# EAGLE design FZZSHAP (EAGLE 9.2.2)
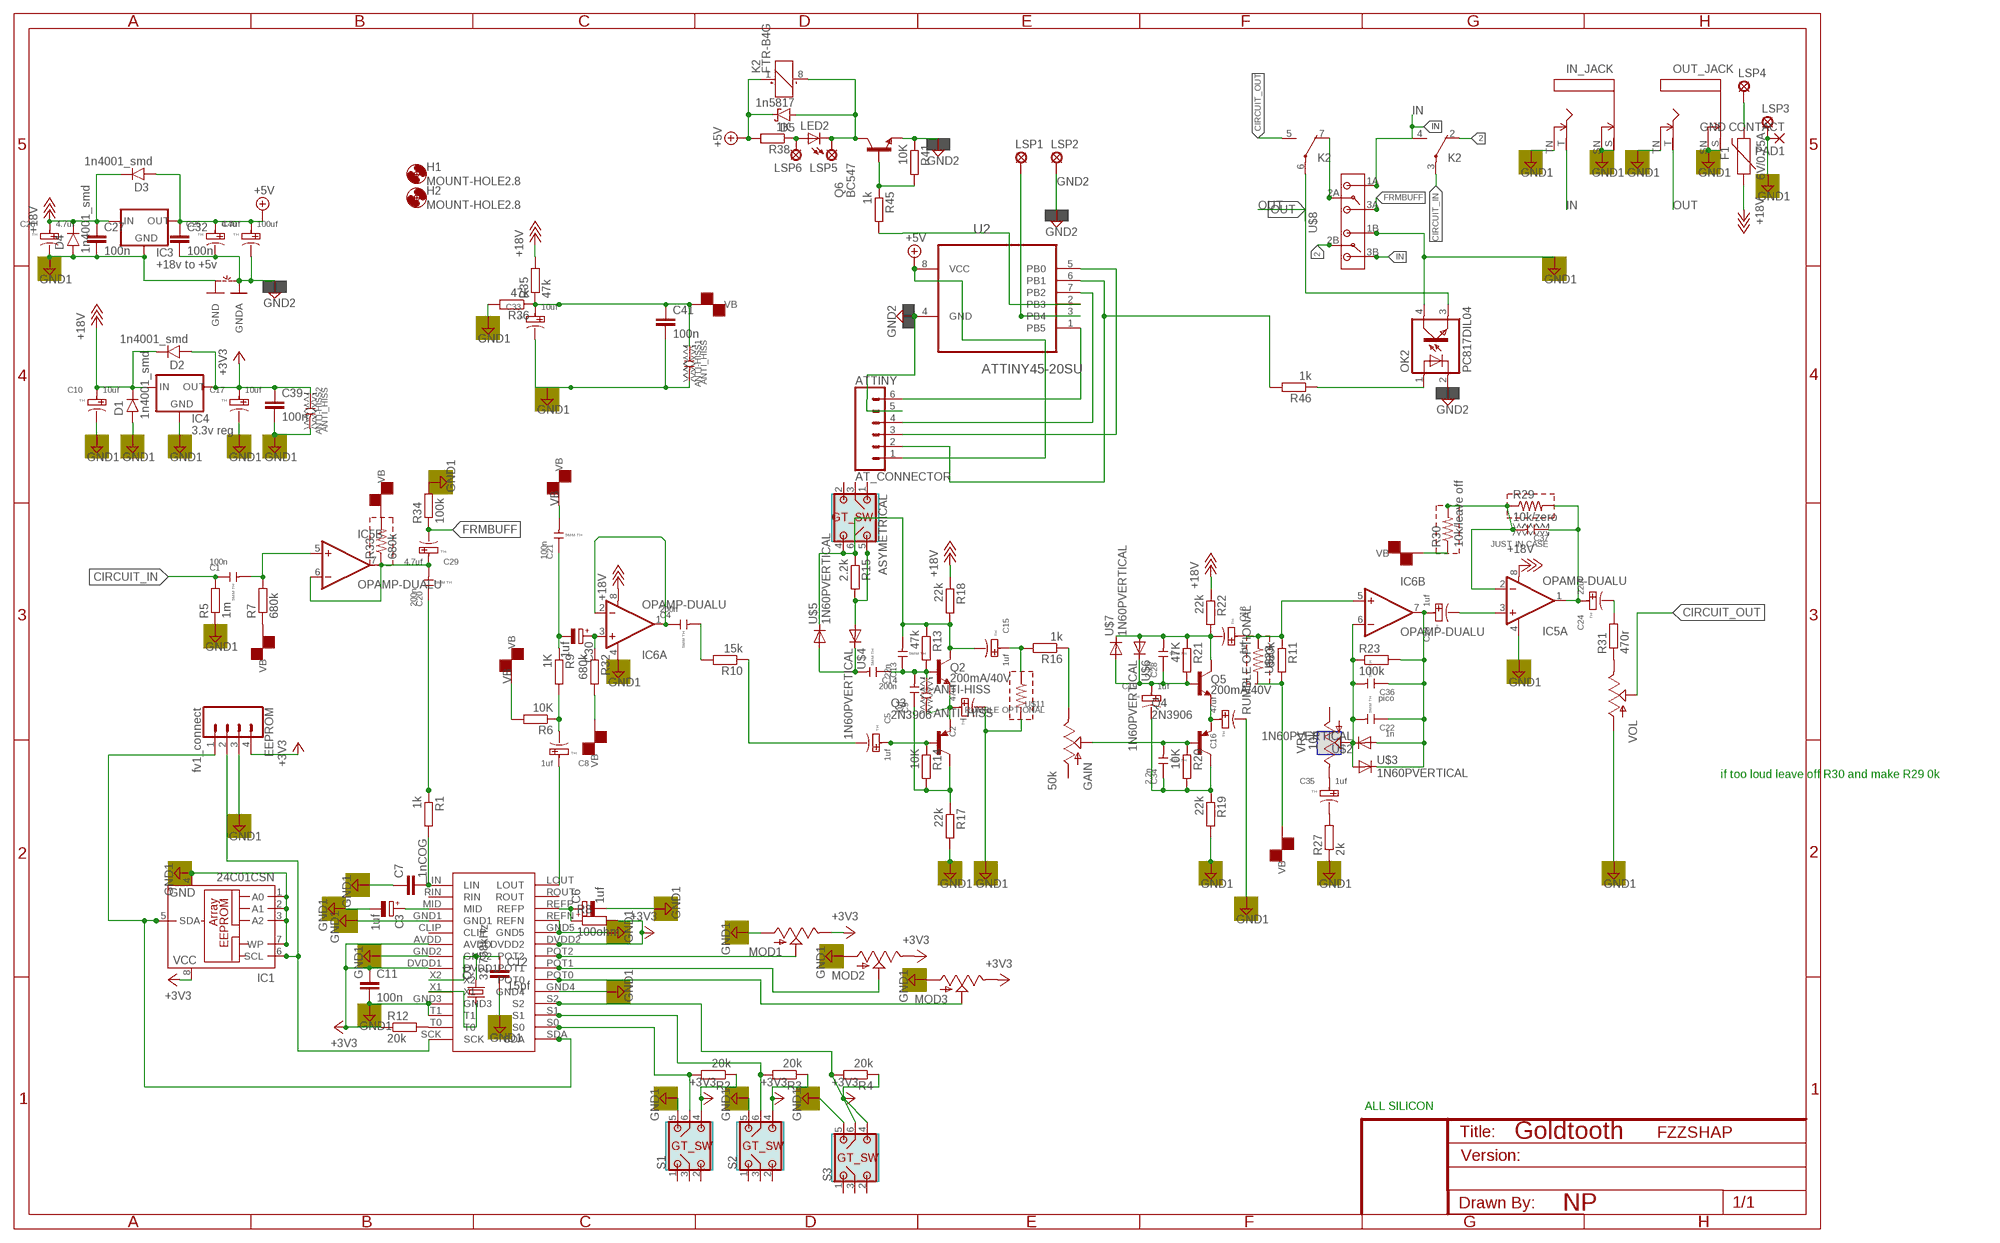
[diagram p0: schematic, sheet 1]

## Parts
ANTI-HISS  ANTI_HISS  SMDCERAMIC_1206_OPTIONAL  [SMD_OPTIONAL]
ANTI-HISS1  ANTI_HISS  SMDCERAMIC_1206_OPTIONAL  [SMD_OPTIONAL]
ANTI-HISS2  ANTI_HISS  SMDCERAMIC_1206_OPTIONAL  [SMD_OPTIONAL]
ASYMETRICAL  DP03HOLD_ADJUSTED  [DP-03_HOLE_ADJUSTED]
ATTINY  AT_CONNECTOR  CONN_06LONGPADS  [1X06_LONGPADS]
C1  100n  THRU_HOLE_5MM_SPACING  [CERAMIC-5MM]
C2  47uf  THRU-HOLE-POLARIZED  [PC-D5.3MM]
C3  1uf  CPOL-EUA/3216-18R  [A/3216-18R]
C4  200n  THRU_HOLE_5MM_SPACING  [CERAMIC-5MM]
C5  1uf  THRU-HOLE-POLARIZED  [PC-D5.3MM]
C6  1uf  CPOL-EUA/3216-18R  [A/3216-18R]
C7  1nCOG  C-EUC0805K  [C0805K]
C8  1uf  THRU-HOLE-POLARIZED  [PC-D5.3MM]
C9  1uf  THRU_HOLE_5MM_SPACING  [CERAMIC-5MM]
C10  10uf  THRU-HOLE-POLARIZED  [PC-D5.3MM]
C11  100n  C-EUC0805  [C0805]
C12  15pf  C-EUC0805  [C0805]
C13  22n  THRU_HOLE_5MM_SPACING  [CERAMIC-5MM]
C14  200n  THRU_HOLE_5MM_SPACING  [CERAMIC-5MM]
C15  1uf  THRU-HOLE-POLARIZED  [PC-D5.3MM]
C16  47uf  THRU-HOLE-POLARIZED  [PC-D5.3MM]
C17  10uf  THRU-HOLE-POLARIZED  [PC-D5.3MM]
C18  1uf  THRU-HOLE-POLARIZED  [PC-D5.3MM]
C19  1uf  THRU-HOLE-POLARIZED  [PC-D5.3MM]
C20  200n  THRU_HOLE_5MM_SPACING  [CERAMIC-5MM]
C21  100n  THRU_HOLE_5MM_SPACING  [CERAMIC-5MM]
C22  1n  THRU_HOLE_5MM_SPACING  [CERAMIC-5MM]
C23  1uf  THRU-HOLE-POLARIZED  [PC-D5.3MM]
C24  22uf  THRU-HOLE-POLARIZED  [PC-D5.3MM]
C25  4.7uf  THRU-HOLE-POLARIZED  [PC-D5.3MM]
C26  4.7uf  THRU-HOLE-POLARIZED  [PC-D5.3MM]
C27  100n  C-EUC1206  [C1206]
C28  2.2n  THRU_HOLE_5MM_SPACING  [CERAMIC-5MM]
C29  4.7uf  THRU-HOLE-POLARIZED  [PC-D5.3MM]
C30  1uf  CPOL-EUA/3216-18R  [A/3216-18R]
C32  100n  C-EUC1206  [C1206]
C33  10uf  THRU-HOLE-POLARIZED  [PC-D5.3MM]
C34  2.2n  THRU_HOLE_5MM_SPACING  [CERAMIC-5MM]
C35  1uf  THRU-HOLE-POLARIZED  [PC-D5.3MM]
C36  pico  THRU_HOLE_5MM_SPACING  [CERAMIC-5MM]
C37  JUST IN CASE  SMDCERAMIC_1206_OPTIONAL  [SMD_OPTIONAL]
C39  100n  C-EUC1206  [C1206]
C40  100uf  THRU-HOLE-POLARIZED  [PC-D5.3MM]
C41  100n  C-EUC1206  [C1206]
D1  1n4001_smd  1N400X.1  [DO41-1]
D2  1n4001_smd  1N400X.1  [DO41-1]
D3  1n4001_smd  1N400X.1  [DO41-1]
D4  1n4001_smd  1N400X.1  [DO41-1]
D5  1n5817  SCHOTTKY-DIODESMD  [SMB]
EEPROM  fv1_connect  CONN_04LONGPADS  [1X04_LONGPADS]
F1  6V/0.75A  PPTC_THREE-QUARTER-AMP  [1206]
GAIN  50k  POTHOLER  [HOLE]
H1  MOUNT-HOLE2.8  [2,8]
H2  MOUNT-HOLE2.8  [2,8]
IC1  24C01CSN  [SO-08]
IC3  +18v to +5v  V_REG_78XX7812  [TO-252]
IC4  3.3v reg  78M33  [SOT223]
IC5  OPAMP-DUALU  [SO08]
IC6  OPAMP-DUALU  [SO08]
IN_JACK  MMMONNN  [MONO]
K2  FTR-B4G  [FTR-B4G]
LED2  LED3MM  [LED3MM]
LSP1  LSP10  [LSP10]
LSP2  LSP10  [LSP10]
LSP3  LSP10  [LSP10]
LSP4  LSP10  [LSP10]
LSP5  LSP10  [LSP10]
LSP6  LSP10  [LSP10]
MOD1  POTHOLER  [HOLE]
MOD2  POTHOLER  [HOLE]
MOD3  POTHOLER  [HOLE]
OK2  PC817DIL04  [SMD4]
OUT_JACK  MMMONNN  [MONO]
PAD1  GND CONTACT  SMD5  [SMD2,54-5,08]
Q1  32.768kHz  CRYSTALTXC-7A  [CRYSTAL-TXC-7A]
Q2  200mA/40V  TRANS_NPN-2N3904  [TO-92]
Q3  2N3906  [TO92]
Q4  2N3906  [TO92]
Q5  200mA/40V  TRANS_NPN-2N3904  [TO-92]
Q6  BC547  [TO92]
R1  1k  R-EU_R1206  [R1206]
R2  20k  R-EU_R1206  [R1206]
R3  20k  R-EU_R1206  [R1206]
R4  20k  R-EU_R1206  [R1206]
R5  1m  R-EU_R1206  [R1206]
R6  10K  R-EU_R1206  [R1206]
R7  680k  R-EU_R1206  [R1206]
R8  100ohm  R-EU_R1206  [R1206]
R9  1K  R-EU_R1206  [R1206]
R10  15k  R-EU_R1206  [R1206]
R11  680k  R-EU_R1206  [R1206]
R12  20k  R-EU_R1206  [R1206]
R13  47k  R-EU_R1206  [R1206]
R14  10K  R-EU_R1206  [R1206]
R15  2.2k  R-EU_R1206  [R1206]
R16  1k  R-EU_R1206  [R1206]
R17  22k  R-EU_R1206  [R1206]
R18  22k  R-EU_R1206  [R1206]
R19  22k  R-EU_R1206  [R1206]
R20  10K  R-EU_R1206  [R1206]
R21  47K  R-EU_R1206  [R1206]
R22  22k  R-EU_R1206  [R1206]
R23  100k  R-EU_R1206  [R1206]
R27  2k  R-EU_R1206  [R1206]
R29  10k/zero  SMD_TOPTIONAL_RESISTOR_1206  [C1206]
R30  10k/leave off  SMD_TOPTIONAL_RESISTOR_1206  [C1206]
R31  470r  R-EU_R1206  [R1206]
R32  680k  R-EU_R1206  [R1206]
R33  680k  SMD_TOPTIONAL_RESISTOR_1206  [C1206]
R34  100k  R-EU_R1206  [R1206]
R35  47k  R-EU_R1206  [R1206]
R36  47k  R-EU_R1206  [R1206]
R38  1K  R-EU_M1206  [M1206]
R41  10K  R-EU_M1206  [M1206]
R45  1k  R-EU_M1206  [M1206]
R46  1k  R-EU_M1206  [M1206]
S1  DP03HOLD_ADJUSTED  [DP-03_HOLE_ADJUSTED]
S2  DP03HOLD_ADJUSTED  [DP-03_HOLE_ADJUSTED]
S3  DP03HOLD_ADJUSTED  [DP-03_HOLE_ADJUSTED]
U2  ATTINY45-20SU  [SOIC127P798X216-8N]
U$1  FV-1SOIC28  [SOIC28]
U$2  1N60PVERTICAL  [DO41-1]
U$3  1N60PVERTICAL  [DO41-1]
U$4  1N60PVERTICAL  [DO41-1]
U$5  1N60PVERTICAL  [DO41-1]
U$6  1N60PVERTICAL  [DO41-1]
U$7  1N60PVERTICAL  [DO41-1]
U$8  BYSWITCH  [BUFF/TRBYPASS]
U$11  RUMBLE OPTIONAL  SMD_TOPTIONAL_RESISTOR_1206  [C1206]
U$23  RUMBLE OPTIONAL  SMD_TOPTIONAL_RESISTOR_1206  [C1206]
VOL  POTHOLER  [HOLE]
VR1  10k  TRIM_US-3223G  [3223G]
~NUDEV~1  GND-GNDA1,27MM  [GND-GNDA-1,27MM]

## Nets
2: K2.2(-1:O) U$8.2B
+3V3: ANTI-HISS2.1 C11.1 C17.+ C39.1 D2.A EEPROM.4 IC1.8(VCC) IC4.3(OUT) MOD1.3(E) MOD2.3(E) MOD3.3(E) R2.1 R3.1 R4.1 R8.2 R12.1 S1.4 S2.4 S3.4 U$1.AVDD U$1.DVDD1 U$1.DVDD2
+5V: ATTINY.1 C25.+ C32.1 C40.+ D3.A D5.C IC3.2(OUT) K2.1(K:+) R38.2 U2.8(VCC)
+18V: C10.+ C26.+ C27.1 D1.C D2.C D3.C D4.C F1.1 IC3.1(IN) IC4.1(IN) IC5.8(A:V+) IC6.8(A:V+) R18.1 R22.1 R35.2
CIRCUIT_IN: C1.1 K2.3(-1:P) R5.2
CIRCUIT_OUT: K2.5(-2:S) VOL.2(S)
FRMBUFF: C29.- R34.1 U$8.3A
FV-1_SW_1: R2.2 S1.6 U$1.S0
FV-1_SW_2: R3.2 S2.6 U$1.S1
FV-1_SW_3: R4.2 S3.6 U$1.S2
GND1: ANTI-HISS1.2 ANTI-HISS2.2 C2.- C3.- C6.- C7.1 C10.- C11.2 C12.2 C16.- C17.- C26.- C27.2 C33.- C39.2 C41.2 D1.A D4.A EEPROM.3 IC1.1(A0) IC1.2(A1) IC1.3(A2) IC1.4(GND) IC1.7(WP) IC3.3(GND) IC4.2(GND) IC4.4(GND) IC5.4(A:V-) IC6.4(A:V-) IN_JACK.S IN_JACK.SN IN_JACK.TN LSP3.MP MOD1.1(A) MOD2.1(A) MOD3.1(A) OK2.4(COL) OUT_JACK.S OUT_JACK.SN OUT_JACK.TN PAD1.1(P) R5.1 R17.2 R19.2 R27.1 R34.2 R36.2 S1.5 S2.5 S3.5 U$1.GND1 U$1.GND2 U$1.GND3 U$1.GND4 U$1.GND5 U$1.REFN U$1.T1 U$8.1B U$11.2 VOL.1(A) ~NUDEV~1.GND
GND2: ATTINY.5 C25.- C32.2 C40.- LSP2.MP OK2.2(C) Q6.1(E) R41.1 U2.4(GND) ~NUDEV~1.GNDA
IN: IN_JACK.T K2.4(-1:S) U$8.1A U$8.3B
LEFT_IN: C20.1 R1.1
LEFT_OUT: C8.+ U$1.LOUT
N$1: C5.+ Q3.2(B) R14.1
N$2: MOD3.2(S) U$1.POT0
N$3: C8.- R6.1 R9.2
N$4: C15.+ R16.2 U$11.1
N$5: C1.2 IC5.5(B:+IN) R7.2
N$6: C4.2 R10.2
N$7: C5.- R10.1
N$8: C21.1 C30.- R9.1
N$10: C4.1 IC6.1(A:OUT) IC6.2(A:-IN)
N$11: ASYMETRICAL.5 R15.2 U$4.A
N$12: C37.2 IC5.2(A:-IN) R29.1 R30.2
N$13: C35.+ VR1.3(E)
N$14: MOD2.2(S) U$1.POT1
N$15: ANTI-HISS.2 C2.+ Q2.1(E) Q3.3(E)
N$16: ASYMETRICAL.4 ASYMETRICAL.6 C13.2 C15.- Q2.3(C) R13.1 R15.1 R18.2 U$5.C
N$17: GAIN.3(E) R16.1
N$18: C9.1 Q3.1(C) R14.2 R17.1
N$19: MOD1.2(S) U$1.POT2
N$20: C30.+ IC6.3(A:+IN) R32.1
N$21: C18.+ IC6.5(B:+IN) R11.1 U$23.1
N$22: C23.- IC5.3(A:+IN)
N$23: C22.1 C23.+ C36.1 IC6.7(B:OUT) R23.2 U$2.A U$3.C
N$24: C35.- R27.2
N$25: C16.+ Q4.3(E) Q5.1(E)
N$26: EEPROM.2 IC1.6(SCL) U$1.SCK
N$27: C24.+ C37.1 IC5.1(A:OUT) R29.2
N$28: EEPROM.1 IC1.5(SDA) U$1.SDA
N$29: C34.2 GAIN.2(S) Q4.2(B) R20.1
N$30: C7.2 R1.2 U$1.LIN
N$31: C19.+ C28.1 Q5.2(B) R21.2 U$6.C U$7.A
N$32: C14.2 U$4.C U$5.A
N$33: C3.+ U$1.MID
N$34: F1.2 LSP4.MP
N$35: C19.- C34.1 Q4.1(C) R19.1 R20.2
N$36: C24.- R31.2
N$38: C22.2 C36.2 IC6.6(B:-IN) R23.1 U$2.C U$3.A VR1.2(S)
N$39: ANTI-HISS1.1 C33.+ C41.1 R35.1 R36.1 ; supply symbol labelled VB
N$40: ANTI-HISS.1 C9.2 C13.1 C14.1 Q2.2(B) R13.2
N$41: C20.2 C29.+ IC5.6(B:-IN) IC5.7(B:OUT) R33.1
N$43: R31.1 VOL.3(E)
N$46: C6.+ R8.1 U$1.REFP
N$51: C18.- C28.2 Q5.3(C) R21.1 R22.2 U$6.A U$7.C
N$52: R12.2 U$1.T0
N$53: C12.1 Q1.P$2 U$1.X2
N$54: Q1.P$1 U$1.X1
N$59: K2.7(-2:O) U$8.2A
N$74: ATTINY.3 U2.5(PB0)
N$75: ATTINY.2 R46.2 U2.6(PB1)
N$76: ATTINY.4 U2.7(PB2)
N$77: ATTINY.6 U2.1(PB5)
N$78: LED2.A LSP6.MP R38.1
N$79: D5.A K2.8(K:-) LED2.K(C) LSP5.MP Q6.3(C)
N$84: Q6.2(B) R41.2 R45.1
N$85: R45.2 U2.2(PB3)
N$87: LSP1.MP U2.3(PB4)
N$88: OK2.1(A) R46.1
OUT: K2.6(-2:P) OK2.3(EMIT) OUT_JACK.T
VB: C21.2 R6.2 R7.1 R11.2 R30.1 R32.2 R33.2 U$23.2
Unconnected: ASYMETRICAL.1 ASYMETRICAL.2 ASYMETRICAL.3 GAIN.1(A) S1.1 S1.2 S1.3 S2.1 S2.2 S2.3 S3.1 S3.2 S3.3 U$1.CLIP U$1.RIN U$1.ROUT VR1.1(A)

## Notes on the sheet
- if too loud leave off R30 and make R29 0k
- ALL SILICON

## Library data of the parts
ANTI-HISS ANTI-HISS1 ANTI-HISS2 C37 = GT_Capacitor:SMDCERAMIC_1206_OPTIONAL
ASYMETRICAL S1-S3 = switch-dil:DP03: DIL/CODE SWITCH
ATTINY = GT_Connectors:CONN_06: Multi connection point. Often used as Generic Header-pin footprint for 0.1 inch spaced/style header connections On any of the 0.1 inch spaced packages, you can populate with these: Break Away Headers - Straight <https://www.sparkfun.com/products/116> (PRT-00116) Break Away Male Headers - Right Angle <https://www.sparkfun.com/products/553> (PRT-00553) Female Headers <https://www.sparkfun.com/products/115> (PRT-00115) Break Away Headers - Machine Pin <https://www.sparkfun.com/products/117> (PRT-00117) Break Away Female Headers - Swiss Machine Pin <https://www.sparkfun.com/products/743> (PRT-00743) Arduino Stackable Header - 6 Pin <https://www.sparkfun.com/products/9280> (PRT-09280) For SCREWTERMINALS and SPRING TERMINALS visit here: Screw Terimnals on SparkFun.com <https://www.sparkfun.com/search/results?term=Screw+Terminals> (5mm/3.5mm/2.54mm spacing) This device is also useful as a general connection point to wire up your design to another part of your project. Our various solder wires solder well into these plated through hole pads. Hook-Up Wire - Assortment (Stranded, 22 AWG) <https://www.sparkfun.com/products/11375> (PRT-11375) Hook-Up Wire - Assortment (Solid Core, 22 AWG) <https://www.sparkfun.com/products/11367> (PRT-11367) View the entire wire category on our website here <https://www.sparkfun.com/categories/141>
C1 C4 C9 C13 C14 C20-C22 C28 C34 C36 = GT_Capacitor:THRU_HOLE_5MM_SPACING: 302010202; PACKAGE: 5MM TH
C2 C5 C8 C10 C15-C19 C23-C26 C29 C33 C35 C40 = GT_Capacitor:THRU-HOLE-POLARIZED: 302030033; PACKAGE: TH
C3 C6 C30 = resistor:CPOL-EU: POLARIZED CAPACITOR, European symbol
C7 C11 C12 C27 C32 C39 C41 = resistor:C-EU: CAPACITOR, European symbol
D1-D4 = gm-diodes:1N400X: Rectifier Diodes often used in power supply to prevent damage from reverse polarization
D5 = diode:SCHOTTKY-DIODE: Schottky Diode
EEPROM = GT_Connectors:CONN_04: Multi connection point. Often used as Generic Header-pin footprint for 0.1 inch spaced/style header connections On any of the 0.1 inch spaced packages, you can populate with these: Break Away Headers - Straight <https://www.sparkfun.com/products/116> (PRT-00116) Break Away Male Headers - Right Angle <https://www.sparkfun.com/products/553> (PRT-00553) Female Headers <https://www.sparkfun.com/products/115> (PRT-00115) Break Away Headers - Machine Pin <https://www.sparkfun.com/products/117> (PRT-00117) Break Away Female Headers - Swiss Machine Pin <https://www.sparkfun.com/products/743> (PRT-00743) For SCREWTERMINALS and SPRING TERMINALS visit here: Screw Terimnals on SparkFun.com <https://www.sparkfun.com/search/results?term=Screw+Terminals> (5mm/3.5mm/2.54mm spacing) This device is also useful as a general connection point to wire up your design to another part of your project. Our various solder wires solder well into these plated through hole pads. Hook-Up Wire - Assortment (Stranded, 22 AWG) <https://www.sparkfun.com/products/11375> (PRT-11375) Hook-Up Wire - Assortment (Solid Core, 22 AWG) <https://www.sparkfun.com/products/11367> (PRT-11367) View the entire wire category on our website here <https://www.sparkfun.com/categories/141> Special notes: Molex polarized connector foot print use with SKU : PRT-08231 with associated crimp pins and housings. 1MM SMD Version SKU: PRT-10208; PROD_ID: CONN-09696
F1 = GOLDTOOTH-Fuses:PPTC: Resettable Fuse PPTC Resettable Fuse. Really a sort of resistor with a polymeric positive temperature coefficient whose resistance increases dramatically with an increase in temperature. When heated by the power passing through the resistance rises causing the current to be limited, protecting the circuit. This is achieved by the transition of the polymer from a crystalline to an amorphous state where the conductive carbon separates breaking the conductive pathways found in the cool crystalline structure. When a PPTC cools back down it resumes conducting letting the circuit turn back on. SparkFun Products: SparkFun RedBoard - Programmed with Arduino <https://www.sparkfun.com/products/12757> Pro Micro - 5V/16MHz <https://www.sparkfun.com/products/12640> Arduino Pro 328 - 5V/16MHz <https://www.sparkfun.com/products/10915> MP3 Trigger <https://www.sparkfun.com/products/13720>; PROD_ID: RES-11150
GAIN MOD1-MOD3 VOL = SparkFun-Electromechanical:POT
H1 H2 = holes:MOUNT-HOLE: MOUNTING HOLE with drill center marker
IC1 = microchip:24C*: Serial EEPROM 1 K/2 K/4 K; MF: MICROCHIP; MPN: 24C01C/SN; OC_FARNELL: unknown; OC_NEWARK: 96K4061
IC3 = SparkFun-IC-Power:V_REG_78XX: Voltage Regulator Standard 78xx regulator. IGO (Input Ground Output). Spark Fun Electronics SKU : COM-00107; PROD_ID: VREG-12370; VALUE: +12v
IC4 = v-reg-2:78M33
IC5 IC6 = SparkFun-AnalogIC:OPAMP-DUAL: Generic op-amp footprint
IN_JACK = gm-jacks2:MMMONNN; SPICEPREFIX: E
K2 = relay:FTR-B4: ULTRA MINIATURE RELAY 2 POLES - 2 A (Slim Profile Signal Relay) FUJITSU FTR-B4 SERIES Source: FTR-B4.pdf
LED2 = GOLDTOOTH_LED:LED: LED OSRAM: - CHIPLED LG R971, LG N971, LY N971, LG Q971, LY Q971, LO R971, LY R971 LH N974, LH R974 LS Q976, LO Q976, LY Q976 LO Q996 - Hyper CHIPLED LW Q18S LB Q993, LB Q99A, LB R99A - SideLED LS A670, LO A670, LY A670, LG A670, LP A670 LB A673, LV A673, LT A673, LW A673 LH A674 LY A675 LS A676, LA A676, LO A676, LY A676, LW A676 LS A679, LY A679, LG A679 - Hyper Micro SIDELED® LS Y876, LA Y876, LO Y876, LY Y876 LT Y87S - SmartLED LW L88C, LW L88S LB L89C, LB L89S, LG L890 LS L89K, LO L89K, LY L89K LS L896, LA L896, LO L896, LY L896 - TOPLED LS T670, LO T670, LY T670, LG T670, LP T670 LSG T670, LSP T670, LSY T670, LOP T670, LYG T670 LG T671, LOG T671, LSG T671 LB T673, LV T673, LT T673, LW T673 LH T674 LS T676, LA T676, LO T676, LY T676, LB T676, LH T676, LSB T676, LW T676 LB T67C, LV T67C, LT T67C, LS T67K, LO T67K, LY T67K, LW E67C LS E67B, LA E67B, LO E67B, LY E67B, LB E67C, LV E67C, LT E67C LW T67C LS T679, LY T679, LG T679 LS T770, LO T770, LY T770, LG T770, LP T770 LB T773, LV T773, LT T773, LW T773 LH T774 LS E675, LA E675, LY E675, LS T675 LS T776, LA T776, LO T776, LY T776, LB T776 LHGB T686 LT T68C, LB T68C - Hyper Mini TOPLED® LB M676 - Mini TOPLED Santana® LG M470 LS M47K, LO M47K, LY M47K Source: http://www.osram.convergy.de LUXEON: - LUMILED® LXK2-PW12-R00, LXK2-PW12-S00, LXK2-PW14-U00, LXK2-PW14-V00 LXK2-PM12-R00, LXK2-PM12-S00, LXK2-PM14-U00 LXK2-PE12-Q00, LXK2-PE12-R00, LXK2-PE12-S00, LXK2-PE14-T00, LXK2-PE14-U00 LXK2-PB12-K00, LXK2-PB12-L00, LXK2-PB12-M00, LXK2-PB14-N00, LXK2-PB14-P00, LXK2-PB14-Q00 LXK2-PR12-L00, LXK2-PR12-M00, LXK2-PR14-Q00, LXK2-PR14-R00 LXK2-PD12-Q00, LXK2-PD12-R00, LXK2-PD12-S00 LXK2-PH12-R00, LXK2-PH12-S00 LXK2-PL12-P00, LXK2-PL12-Q00, LXK2-PL12-R00 Source: www.luxeon.com KINGBRIGHT: KA-3528ASYC Source: www.kingbright.com
LSP1-LSP6 = solpad:LSP10: SOLDER PAD drill 1.0 mm, distributor Buerklin, 12H555
OK2 = GT_optocoupler:PC817: SHARP OPTO COUPLER
OUT_JACK = gm-jacks2:MMMONNN
PAD1 = wirepad:SMD5: SMD PAD
Q1 = SparkFun-FreqCtrl:CRYSTAL: Various standard crystals. Proven footprints. Spark Fun Electronics SKU : COM-00534
Q2 Q5 = SparkFun-DiscreteSemi:TRANS_NPN: NPN transistor Current controlled devices typically used to amplify current or used as a switch. BC547 - COM-08928 <http://www.sparkfun.com/products/8928> (TO-92 45V 100mA) (1.Collector 2.Base 3.Emitter) 2N3904 - COM-00521 <http://www.sparkfun.com/products/521> (TO-92 40V 200mA) (1.Emitter 2.Base 3.Collector) P2N2222A - COM-12852 <http://www.sparkfun.com/products/12852> (TO-92 40V 600mA) (1.Collector 2.Base 3.Emitter); PROD_ID: TRANS-08447
Q3 Q4 = transistor-pnp:2N3906: PNP Transistor
Q6 = transistor-npn:BC547*: NPN Transistor
R1-R23 R27 R31 R32 R34-R36 R38 R41 R45 R46 = resistor:R-EU_: RESISTOR, European symbol
R29 R30 R33 U$11 U$23 = GT_Capacitor:SMD_TOPTIONAL_RESISTOR_1206
U2 = Atmel_By_element14_Batch_1-00:ATTINY45-20SU: 8-bit Microcontroller with 4 Bytes In-System Programmable Flash; MPN: ATTINY45-20SU; OC_FARNELL: 1288353; OC_NEWARK: 23M5073; PACKAGE: SOIC-8; SUPPLIER: Atmel
U$1 = spinsemi:FV-1
U$2-U$7 = diode:1N60P
U$8 = switch-dil:BYSWITCH
VR1 = pot:TRIM_US-: POTENTIOMETER
~NUDEV~1 = ground-junctions:GND-GNDA: Connect GND - GNDA without DRC-Error, display layer 53 (54) to make copper (ROUTE) from GND to GNDA Select also layer 53 (54) in CAM-Job!

## Board
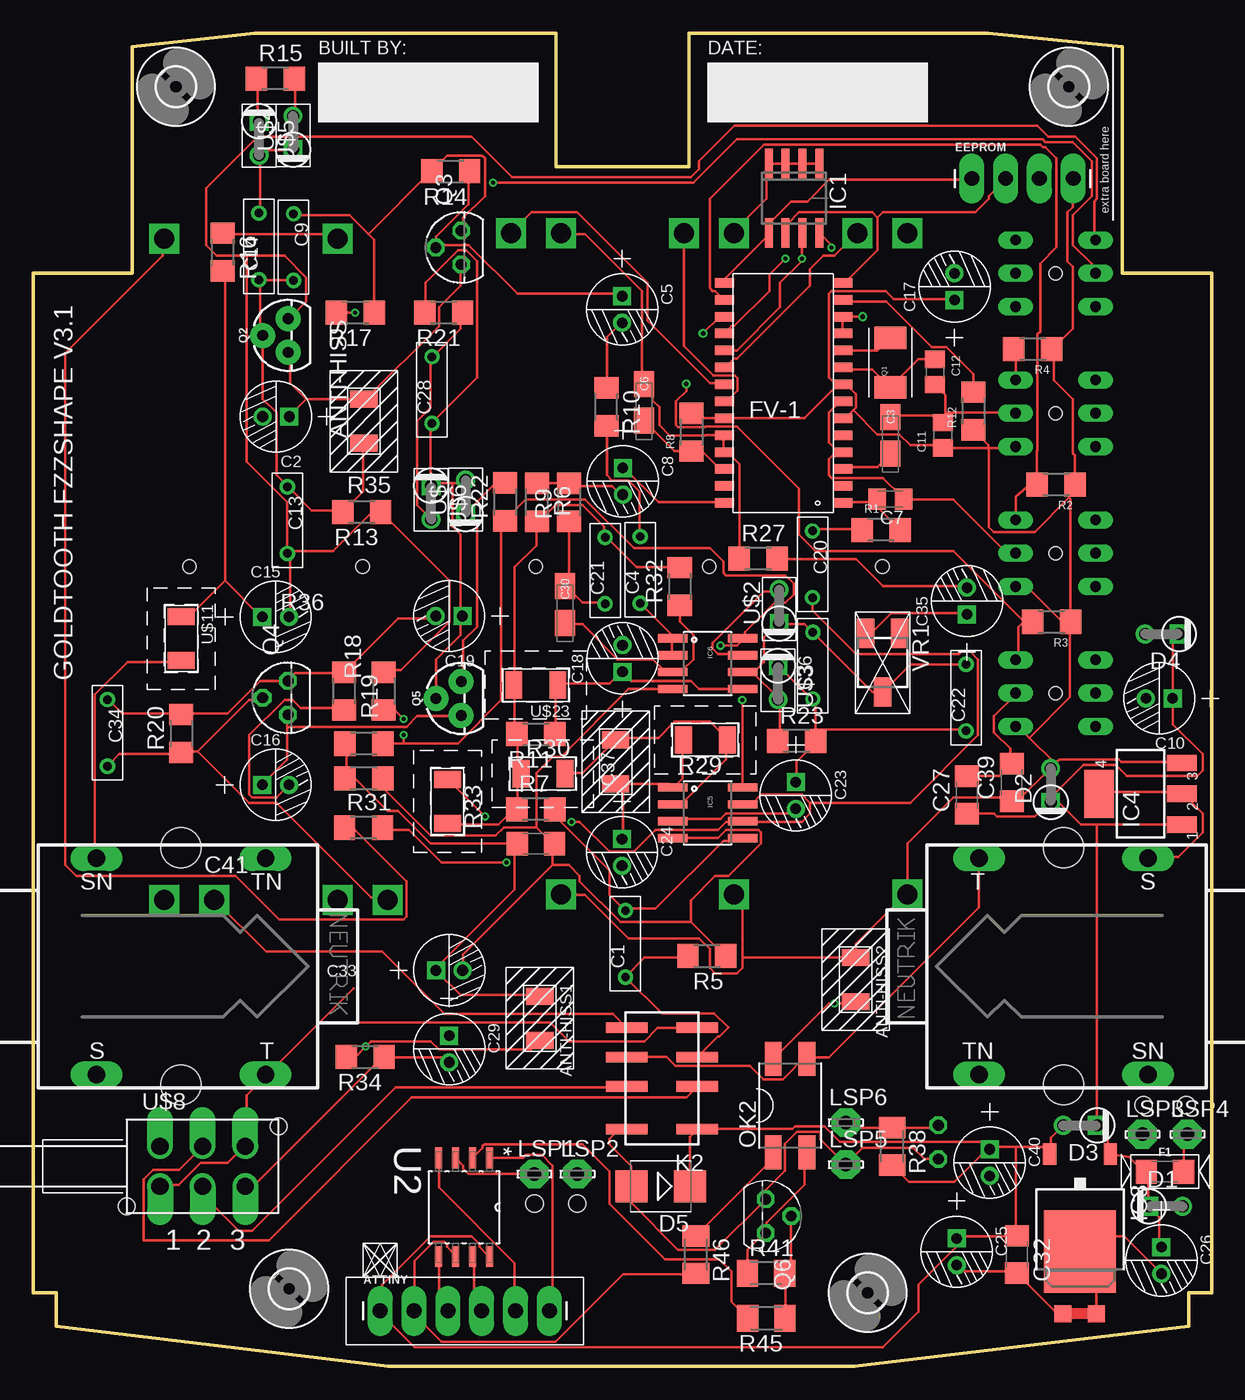
[diagram p1: board, top side]
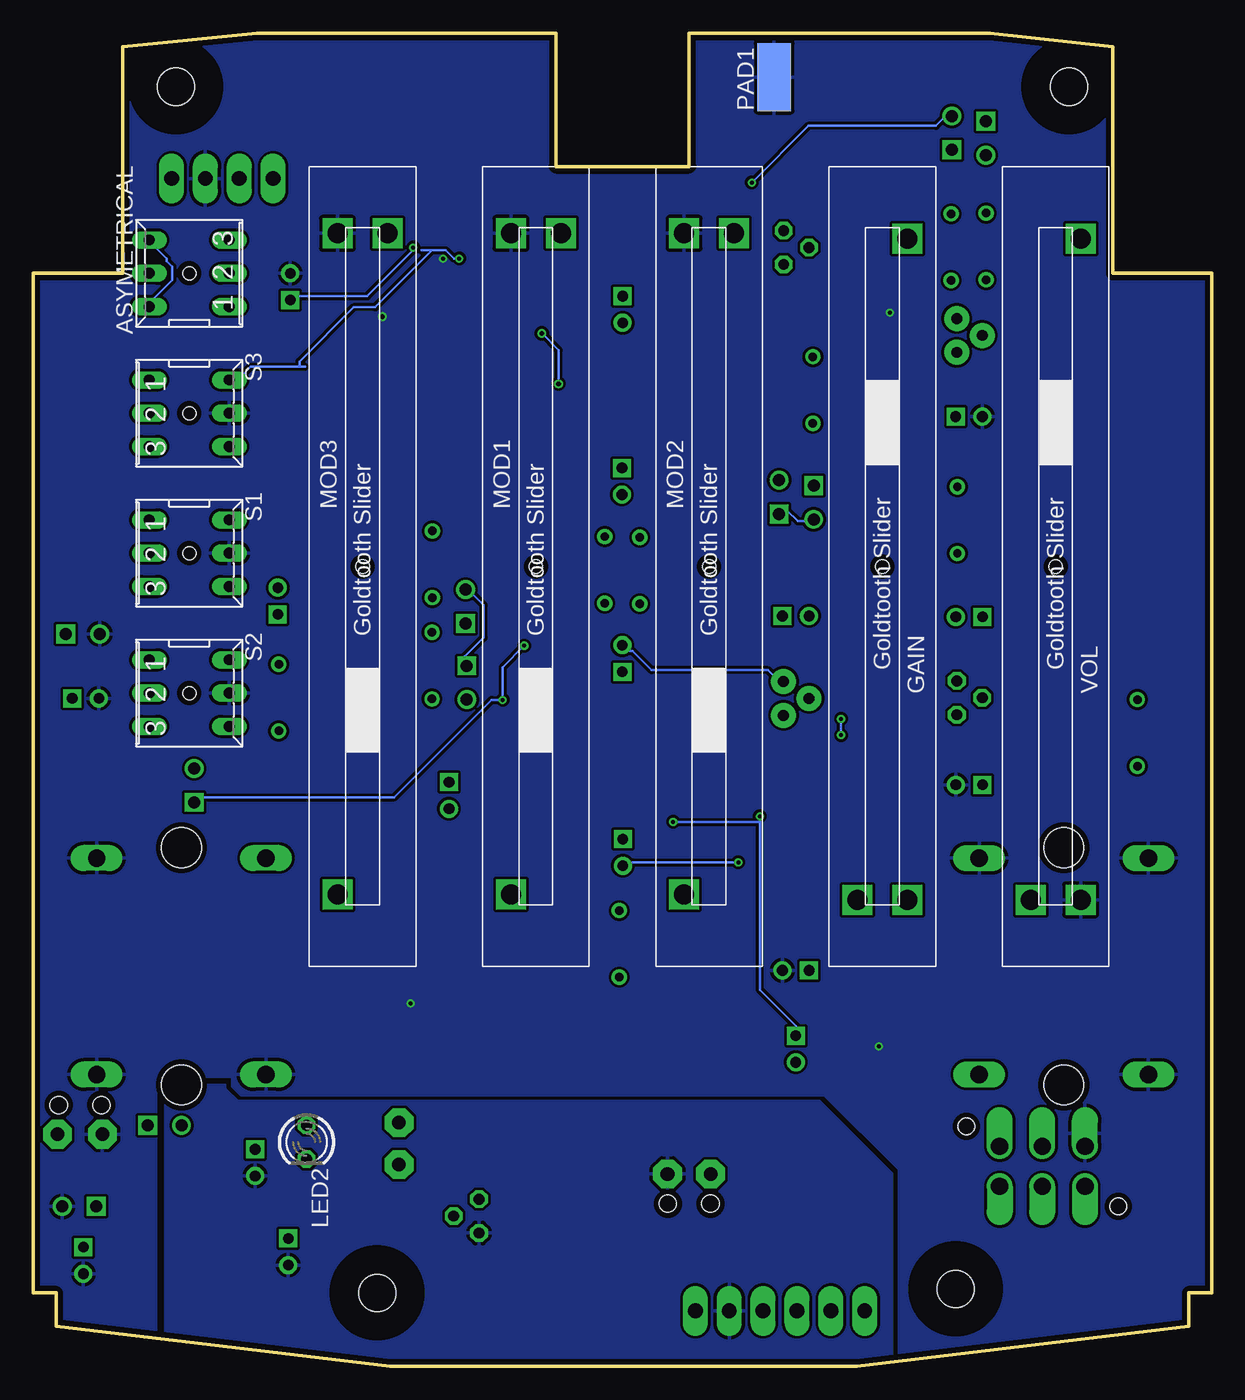
[diagram p2: board, bottom side, seen from below]

Size 88.4 x 100 mm. Coordinates in mm from the lower left corner, seen from the top.
Outline: 0,82 0,5.5 1.7,5.5 1.7,3 26.62,0 61.62,0 86.7,3 86.7,5.5 88.4,5.5 88.4,82 81.7,82 81.7,99 71.62,100 49.2,100 49.2,90 39.2,90 39.2,100 16.62,100 7.4,99 7.4,82 0,82
Copper layers (1*16): Top 0.035mm / dielectric 1.5mm / Bottom 0.035mm
Design rules "GT *": minimum track width 8mil, minimum drill 0.3mm, track to track 8mil, track to pad 6mil, pad to pad 6mil, via to via 6mil, smd to smd 0mil, copper to edge 0.4mm, drill to drill 10mil, minimum pad ring 10mil, minimum via ring 6mil, stop-mask expansion 2mil, vias tented up to drill 25mil, thermal gap 10mil

### Footprints (pad centres in the part's own frame; a part is rotated, then mirrored left to right if it is on the bottom)
SMD_OPTIONAL = smd 1.27 x 2.032: 1 -1.651,0; 2 1.651,0
DP-03_HOLE_ADJUSTED = drill 0.813 long: 1 -2.5,-3; 2 0,-3; 3 2.5,-3; 4 2.5,3; 5 0,3; 6 -2.5,3 | hole 1: 0,0
1X06_LONGPADS = drill 1.118 pad 1.88 long: 1 0,0; 2 2.54,0; 3 5.08,0; 4 7.62,0; 5 10.16,0; 6 12.7,0
CERAMIC-5MM = drill 0.635 pad 1.143: 1 -2.5,0; 2 2.5,0
PC-D5.3MM = drill 0.8 pad 1.35 square: + -1,0 | drill 0.8 pad 1.35: - 1,0
A/3216-18R = smd 1.95 x 1.5: + 1.375,0; - -1.375,0
C0805K = smd 1.3 x 1.6: 1 -1,0; 2 1,0
C0805 = smd 1.3 x 1.5: 1 -0.95,0; 2 0.95,0
C1206 = smd 1.6 x 1.8: 1 -1.4,0; 2 1.4,0
DO41-1 = drill 0.9: A 1.27,0 | drill 0.9 square: C -1.27,0
SMB = smd 2.4 x 2.4: A 2.2,0; C -2.2,0
1X04_LONGPADS = drill 1.118 pad 1.88 long: 1 0,0; 2 2.54,0; 3 5.08,0; 4 7.62,0
1206 = smd 1.6 x 1.8: 1 -1.4,0; 2 1.4,0
HOLE = drill 1.5 square: 1 -25,-1.875; 2 -25,1.875; 3 24.6,-1.875 | hole 1: 0,0
2,8 = hole 2.8: 0,0
SO-08 = smd 0.6 x 2.2: 1 -1.905,-2.6; 2 -0.635,-2.6; 3 0.635,-2.6; 4 1.905,-2.6; 5 1.905,2.6; 6 0.635,2.6; 7 -0.635,2.6; 8 -1.905,2.6
TO-252 = smd 1 x 1.6: 1 -2.28,-4.8; 2 2.28,-4.8 | smd 5.4 x 6.2: 3 0,2.5
SOT223 = smd 1.219 x 2.235: 1 -2.311,-3.099; 2 0,-3.099; 3 2.311,-3.099 | smd 3.6 x 2.2: 4 0,3.099
SO08 = smd 0.61 x 2.21: 1 -1.905,-2.616; 2 -0.635,-2.616; 3 0.635,-2.616; 4 1.905,-2.616; 5 1.905,2.616; 6 0.635,2.616; 7 -0.635,2.616; 8 -1.905,2.616
MONO = drill 1.3 long: S 6.35,8.115; SN 6.35,-8.115; T -6.35,8.115; TN -6.35,-8.115 | hole 3: 0,8.89; 0,-8.89
FTR-B4G = smd 0.8 x 3.1: 1 -3.8,-2.65; 2 -0.6,-2.65; 3 1.6,-2.65; 4 3.8,-2.65; 5 3.8,2.65; 6 1.6,2.65; 7 -0.6,2.65; 8 -3.8,2.65
LED3MM = drill 0.813 octagon: A -1.27,0; K 1.27,0
LSP10 = drill 1.016 pad 2.159 octagon: MP 0,0
SMD4 = smd 1.27 x 2.54: 1 -1.27,-3.5; 2 1.27,-3.5; 3 1.27,3.5; 4 -1.27,3.5
SMD2,54-5,08 = smd 2.54 x 5.08: 1 0,0
CRYSTAL-TXC-7A = smd 1.7 x 2.4: P$1 1.85,0; P$2 -1.85,0
TO-92 = drill 0.813 pad 1.88: 1 -1.27,0; 2 0,1.905; 3 1.27,0
TO92 = drill 0.813 octagon: 1 1.27,0; 2 0,1.905; 3 -1.27,0
R1206 = smd 1.6 x 1.803: 1 -1.422,0; 2 1.422,0
C1206' = smd 1.27 x 2.032: 1 -1.651,0; 2 1.651,0
M1206 = smd 1.6 x 2: 1 -1.4,0; 2 1.4,0
SOIC127P798X216-8N = smd 1.549 x 0.533: 1 -3.708,1.905; 2 -3.708,0.635; 3 -3.708,-0.635; 4 -3.708,-1.905; 5 3.708,-1.905; 6 3.708,-0.635; 7 3.708,0.635; 8 3.708,1.905
SOIC28 = smd 1.422 x 0.711: AVDD -4.445,1.27; CLIP -4.445,2.54; DVDD1 -4.445,-1.27; DVDD2 4.445,1.27; GND1 -4.445,3.81; GND2 -4.445,0; GND3 -4.445,-5.08; GND4 4.445,-3.81; GND5 4.445,2.54; LIN -4.445,7.62; LOUT 4.445,7.62; MID -4.445,5.08; POT0 4.445,-2.54; POT1 4.445,-1.27; POT2 4.445,0; REFN 4.445,3.81; REFP 4.445,5.08; RIN -4.445,6.35; ROUT 4.445,6.35; S0 4.445,-7.62; S1 4.445,-6.35; S2 4.445,-5.08; SCK -4.445,-8.89; SDA 4.445,-8.89; T0 -4.445,-7.62; T1 -4.445,-6.35; X1 -4.445,-3.81; X2 -4.445,-2.54
BUFF/TRBYPASS = drill 1.3 offset: 1A -3.2,-1.5; 1B -3.2,1.5; 2A 0,-1.5; 2B 0,1.5; 3A 3.2,-1.5; 3B 3.2,1.5 | hole 1.25: -5.7,-3; 5.7,3
HOLD = hole 1.3: 0,0
3223G = smd 2.184 x 1.321: 1 -2.2,1.273; 2 2.2,0; 3 -2.2,-1.273
GND-GNDA-1,27MM = smd 1.27 x 1.27: GND -1.27,0; GNDA 1.27,0

### Placement (x,y rotation side)
ANTI-HISS  24.8,70.9 90 top
ANTI-HISS1  38,26.1 270 top
ANTI-HISS2  61.7,29 270 top
ASYMETRICAL  76.7,82 90 bottom
ATTINY  26.02,4.14 0 top
C1  44.43,31.69 90 top
C2  18.2,71.24 180 top
C3  64.31,69.85 270 top
C4  45.53,59.74 90 top
C5  44.19,79.28 270 top
C6  45.82,72.31 270 top
C7  64.31,65.06 180 top
C8  44.23,66.39 270 top
C9  19.53,83.96 270 top
C10  84.48,50.1 180 top
C11  68.24,69.85 90 top
C12  67.66,74.59 270 top
C13  19.07,63.48 270 top
C14  16.92,84.01 90 top
C15  18.18,56.23 0 top
C16  18.18,43.62 0 top
C17  69.12,80.99 90 top
C18  44.21,53.1 90 top
C19  31.19,56.28 180 top
C20  58.46,60.16 270 top
C21  42.9,59.7 90 top
C22  69.99,50.16 90 top
C23  57.21,42.81 270 top
C24  44.17,38.55 270 top
C25  69.28,8.58 270 top
C26  84.64,7.93 270 top
C27  70.04,42.85 90 top
C28  29.91,73.23 90 top
C29  31.2,23.8 270 top
C30  39.88,57.15 270 top
C32  73.78,8.38 270 top
C33  31.2,29.7 0 top
C34  5.57,47.52 270 top
C35  70.06,57.41 90 top
C36  58.49,52.56 90 top
C37  43.69,45.34 90 top
C39  73.4,43.8 90 top
C40  71.76,15.28 270 top
C41  37.7,39.2 0 top
D1  84.96,11.98 0 top
D2  76.33,43.58 90 top
D3  78.55,18.06 180 top
D4  84.69,54.94 180 top
D5  47.07,13.5 180 top
EEPROM  70.41,89.11 0 top
F1  84.9,14.6 0 top
GAIN  24.7,60 90 bottom
H1  10.7,96 0 top
H2  77.7,96 0 top
H3  MOUNT-HOLE2.8  [2,8]  62.6,5.5 0 top
H4  MOUNT-HOLE2.8  [2,8]  19.2,5.8 0 top
IC1  57.08,87.63 180 top
IC3  78.53,11.11 180 top
IC4  83.07,42.95 90 top
IC5  50.6,41.52 270 top
IC6  50.6,52.7 270 top
IN_JACK  11.08,30 180 top
K2  47.17,21.59 90 top
LED2  67.9,16.81 270 bottom
LSP1  37.59,14.42 0 top
LSP2  40.82,14.42 0 top
LSP3  83.22,17.4 0 top
LSP4  86.59,17.4 0 top
LSP5  60.96,15.12 0 top
LSP6  60.96,18.27 0 top
MOD1  50.7,60 270 bottom
MOD2  37.7,60 270 bottom
MOD3  63.7,60 270 bottom
OK2  56.78,19.55 0 top
OUT_JACK  77.3,30 0 top
PAD1  32.82,96.7 0 bottom
Q1  64.31,75.3 90 top
Q2  19.11,77.33 90 top
Q3  32.11,83.93 90 top
Q4  19.11,50.15 90 top
Q5  32.11,50.1 90 top
Q6  54.96,11.26 270 top
R1  63.62,62.74 0 top
R2  76.73,66.16 180 top
R3  76.39,55.85 180 top
R4  74.98,76.32 180 top
R5  50.54,30.78 180 top
R6  37.8,64.82 270 top
R7  37.7,41.78 0 top
R8  49.39,70.08 90 top
R9  40.2,64.82 90 top
R10  42.99,71.97 270 top
R11  37.7,47.42 180 top
R12  70.52,71.66 90 top
R13  24.64,64.09 180 top
R14  31.31,89.64 180 top
R15  18.16,96.61 0 top
R16  14.22,83.59 270 top
R17  24.16,79.06 180 top
R18  26.29,50.65 90 top
R19  23.33,50.65 270 top
R20  11.11,47.47 90 top
R21  30.79,79.06 180 top
R22  35.4,64.85 90 top
R23  57.28,46.9 0 top
R27  54.4,60.59 0 top
R29  10k/zero  [C1206']  50.42,46.99 180 top
R30  10k/leave off  [C1206']  38.23,44.45 0 top
R31  24.78,40.4 0 top
R32  48.5,58.5 90 top
R33  680k  [C1206']  31.08,42.37 270 top
R34  24.9,23.2 180 top
R35  24.8,46.7 0 top
R36  24.8,44.1 0 top
R38  64.44,16.49 270 top
R41  54.98,6.96 0 top
R45  55,3.6 180 top
R46  49.72,8.38 270 top
S1  76.7,61 270 bottom
S2  76.7,50.5 270 bottom
S3  76.7,71.5 270 bottom
U2  32.32,11.93 270 top
U$1  56.31,72.39 180 top
U$2  55.96,56.99 90 top
U$3  55.88,51.28 270 top
U$4  19.48,92.53 90 top
U$5  16.94,92.13 270 top
U$6  29.85,64.81 270 top
U$7  32.44,65.2 90 top
U$8  12.7,15 0 top
U$11  RUMBLE OPTIONAL  [C1206']  11.1,54.59 270 top
U$17  [HOLD]  37.6,12.2 0 top
U$18  [HOLD]  40.8,12.2 0 top
U$19  [HOLD]  83.3,19.6 0 top
U$20  [HOLD]  86.5,19.6 0 top
U$23  RUMBLE OPTIONAL  [C1206']  37.7,51.1 180 top
VOL  11.7,60 90 bottom
VR1  63.73,52.79 270 top
~NUDEV~1  78.5,3.92 180 top

### Tracks (layer width: path | path; a pad name or v marks a point on that pad's centre or on a via)
2
  Top 0.203: 49.73,21.13 K2.2 48.99,20.16 28.39,20.16 17.68,9.45 8.27,9.45 8.27,14.01 8.99,14.73 10.93,14.73 U$8.2B 12.55,16.66
+3V3  (via drill 0.3)
  Top 0.203: v59.9,83.92 59.9,84.12 59.08,84.94 IC1.8 | 71.68,68.89 73.71,68.89 S3.4 | 71.68,68.89 71.67,68.89 | 71.67,68.89 68.43,68.89 C11.1 68.23,69.09 65.79,69.09 64.98,69.9 63.35,69.9 61.52,71.73 | 60.3,73.56 57.86,71.12 U$1.DVDD2 49.76,71.12 R8.2 49.35,71.67 | 60.3,73.56 60.71,73.56 U$1.DVDD1 | 61.52,71.73 61.72,71.93 61.72,72.95 60.91,73.76 U$1.DVDD1 | 61.52,71.73 60.91,71.12 U$1.AVDD | 53.19,30.68 53.19,34.75 52.58,35.36 MOD1.3 | 53.19,30.68 53.19,29.87 52.78,29.46 51.16,29.46 50.75,29.87 50.75,31.29 49.94,32.11 44.66,32.11 41.4,35.36 39.58,35.36 MOD2.3 | 53.19,30.68 61.52,30.68 ANTI-HISS2.1 61.72,30.68 61.72,31.7 65.38,35.36 MOD3.3 65.59,35.56 65.59,39.22 69.04,42.67 73.1,42.67 73.31,42.47 C39.1 73.51,42.47 73.92,42.47 76.15,44.7 D2.A | 76.76,45.31 76.35,44.91 D2.A | 76.76,45.31 76.96,45.52 81.43,45.52 81.64,45.31 86.11,45.31 IC4.3 | 74.73,47.14 76.56,45.31 76.76,45.31 | 74.73,47.14 73.92,47.95 S2.4 | 76.76,45.31 D2.A | R3.1 77.78,55.88 77.17,55.88 74.73,58.32 73.92,58.32 S1.4 | EEPROM.4 77.98,89 77.98,86.97 77.57,86.56 77.57,82.91 77.98,82.5 77.98,77.83 76.56,76.4 R4.1 76.56,76.2 76.56,73.97 77.98,72.54 77.98,68.48 78.16,68.34 R2.1 78.16,65.61 77.7,65.16 | 74.73,47.14 77.78,50.19 77.78,55.68 R3.1 | 71.68,68.89 71.68,62.97 72.07,62.59 75.14,62.59 77.7,65.16 | 77.7,65.16 77.81,65.05 R3.1 | 71.67,68.89 71.67,69.09 R12.1 | 60.3,73.56 59.69,74.17 59.69,80.47 59.9,80.67 63.96,80.67 64.57,80.06 69.04,80.06 C17.+ | 60.3,73.56 U$1.DVDD1
  Bottom 0.203: v59.9,83.92 59.9,83.72 63.35,80.26 68.84,80.26 69.04,80.06 C17.+
+5V
  Top 0.203: 73.71,16.46 71.88,16.46 | 71.88,16.46 71.78,16.31 | 71.78,16.31 C40.+ | 73.71,16.46 73.71,9.96 C32.1 73.71,9.75 69.45,9.75 C25.+ 69.24,9.55 69.24,8.94 66.4,6.1 66.4,4.06 63.76,1.42 28.6,1.42 25.96,4.06 ATTINY.1 26.16,4.27 26.16,6.1 29.82,9.75 32.87,9.75 33.48,9.14 33.48,8.94 34.09,8.33 U2.8 | 49.33,13.61 D5.C 49.27,17.21 49.73,17.68 K2.1 56.95,17.79 57.14,17.98 59.36,17.98 60.51,16.84 71.25,16.84 71.78,16.31 | R38.2 65.7,13.83 69.12,13.83 71.75,16.46 71.88,16.46 | 73.71,16.46 75.7,16.46 IC3.2 76.35,16.01 76.35,17.13 D3.A
  Bottom 0.203: 25.96,5.89 25.96,4.27 ATTINY.1
+18V  (via drill 0.3)
  Top 0.203: v53.19,49.99 53.19,43.48 IC5.8 | v51.56,54.05 52.78,54.05 53.19,54.46 IC6.8 53.39,54.66 53.39,55.07 55.63,57.3 56.44,57.3 57.05,57.91 57.05,58.73 56.44,59.33 51.97,59.33 51.77,59.54 51.77,60.35 50.75,61.37 45.06,61.37 41.4,65.02 36.93,65.02 35.51,63.6 R22.1 35.31,63.4 35.11,63.2 35.11,49.99 31.85,46.74 27.79,46.74 | 27.79,46.74 26.37,46.74 R35.2 | v27.79,48.56 27.18,49.17 26.37,49.17 R18.1 | 27.79,46.74 v27.79,47.35 | C26.+ 84.48,8.94 84.48,11.18 83.87,11.79 D1.C 83.67,11.99 83.67,14.43 F1.1 83.47,14.43 82.19,15.71 IC3.1 80.62,16.1 80.62,17.26 D3.C 79.81,18.07 79.81,40.64 | D4.C 85.91,54.86 85.5,54.46 85.5,50.19 C10.+ 85.5,49.99 85.5,48.16 87.73,45.92 87.73,44.7 87.33,44.3 82.04,44.3 81.23,45.11 78.79,45.11 76.15,42.47 D2.C | C27.1 70.06,41.45 72.09,41.45 72.29,41.25 75.14,41.25 76.15,42.27 D2.C | 79.81,40.64 78.61,40.64 76.94,42.31 D2.C | 79.81,40.64 86.11,40.64 IC4.1
  Bottom 0.203: v51.56,54.05 53.19,52.43 v53.19,49.99 54,49.99 61.32,42.67 75.95,42.67 76.15,42.47 D2.C | v27.79,47.35 v27.79,48.56
CIRCUIT_IN
  Top 0.203: R5.2 48.92,30.68 45.87,30.68 44.45,29.26 C1.1 | 48.72,23.37 49.73,23.37 K2.3 51.37,24.74 51.48,24.74 52.14,25.4 51.08,26.46 47.16,26.46 C1.1 | 44.45,29.06 C1.1
CIRCUIT_OUT
  Top 0.203: K2.5 43.49,26.42 30.87,26.42 26.17,31.11 17.46,31.11 VOL.2
FRMBUFF
  Top 0.203: C29.- 31.04,22.96 30.84,23.16 26.37,23.16 R34.1 26.16,23.16 16.61,13.61 16,13.61 U$8.3A
FV-1_SW_1
  Top 0.203: U$1.S0 51.77,80.06 51.16,80.67 50.95,80.67 50.75,80.87 50.75,87.58 54.82,91.64 75.54,91.64 75.75,91.44 75.95,91.44 76.76,90.63 76.76,83.94 75.54,82.72 75.54,77.62 75.34,77.42 75.34,68.69 75.31,68.66 R2.2 74.75,66.16 73.71,65.23 73.71,63.6 S1.6
FV-1_SW_2  (via drill 0.35)
  Top 0.203: 74.32,55.88 69.04,61.16 58.68,61.16 57.46,62.38 57.46,65.84 52.78,70.51 50.46,70.51 50.39,70.44 48.38,70.44 48.23,70.59 48.23,72.4 48.99,73.16 v48.99,73.71 | 74.32,55.88 74.93,55.88 R3.2 74.32,55.88 | 51.77,78.64 U$1.S1 51.5,78.74 v50.25,77.49 | 74.32,55.88 73.92,55.47 73.92,53.24 S2.6
  Bottom 0.203: v48.99,73.71 48.99,76.23 v50.25,77.49
FV-1_SW_3  (via drill 0.3)
  Top 0.203: v56.44,83.11 55.22,81.89 55.22,80.67 52.58,78.03 52.38,78.03 51.97,77.62 U$1.S2 | R4.2 73.71,76.2 73.71,74.17 S3.6
  Bottom 0.203: v56.44,83.11 56.85,83.11 57.46,83.72 58.47,83.72 | 59.29,83.72 58.47,83.72 | 68.43,74.98 72.09,74.98 72.9,74.17 73.71,74.17 S3.6 | 68.43,74.98 68.02,74.98 | 68.43,74.98 68.43,75.39 64.37,79.45 62.74,79.45 58.47,83.72
GND1  (via drill 0.3, 0.35)
  Top 0.203: U$1.GND5 51.77,69.7 51.77,68.68 U$1.REFN 51.97,68.68 52.99,67.67 52.99,60.76 R27.1 | 46.48,73.56 46.47,73.56 | 46.47,73.56 45.87,73.56 C6.- 45.67,73.76 45.67,80.67 41.4,84.94 39.58,84.94 MOD2.1 | 51.77,69.9 U$1.GND5 | R34.2 23.52,23.37 24.34,23.37 v24.95,23.98 25.35,24.38 29.82,24.38 30.43,23.77 37.34,23.77 37.95,24.38 ANTI-HISS1.2 | 68.43,71.53 68.43,71.32 | 68.43,71.32 68.43,70.92 C11.2 68.43,71.32 | 60.71,77.42 U$1.GND3 60.71,77.62 60.71,78.64 U$1.T1 v62.21,78.74 v62.22,78.75 | 68.43,71.32 64.37,71.32 C3.- | U$1.GND4 52.78,76.2 56.03,79.45 56.03,81.28 57.66,82.91 v57.66,83.11 57.66,84.94 IC1.7 | ANTI-HISS2.2 61.52,27.23 v60.1,27.23 59.69,27.23 55.63,23.16 OK2.4 | 60.3,68.68 60.71,68.68 U$1.GND1 60.3,68.68 | 60.3,68.68 59.69,69.29 59.69,71.53 60.71,72.54 U$1.GND2 | 60.3,68.68 59.69,68.07 59.69,66.85 59.9,66.65 63.76,66.65 65.18,65.23 C7.1 65.34,65.02 69.02,65.02 73.04,61 S1.5 | IC4.4 80.01,43.08 86.11,43.08 IC4.2 86.31,42.88 87.73,41.45 87.73,40.03 85.91,38.2 83.67,38.2 OUT_JACK.S | IC1.1 58.88,90.22 57.86,90.22 IC1.2 57.66,90.22 56.64,90.22 IC1.3 55.22,90.22 IC1.4 55.02,90.22 55.02,87.58 52.58,85.14 MOD1.1 | C27.2 70.06,44.3 72.49,44.3 73.31,45.11 C39.2 73.31,45.31 73.31,46.33 72.09,47.55 72.09,48.77 73.71,50.39 S2.5 | 38.97,37.59 38.97,39.01 C41.2 38.97,39.22 37.75,40.44 | 38.97,37.59 32.26,30.89 32.26,29.87 C33.- | 37.75,40.44 35.31,40.44 34.7,39.83 29.82,39.83 26.37,43.28 26.37,44.09 R36.2 | R19.2 23.32,49.38 20.07,49.38 19.46,49.99 18.85,49.99 16.21,47.35 16.21,42.88 16.41,42.67 18.24,42.67 19.05,43.48 C16.- | 49.33,33.33 51.77,30.89 R5.1
  Top 0.203: 49.33,33.33 44.05,33.33 41,36.37 41,36.78 40.19,37.59 38.97,37.59 | v24.13,79.05 22.91,79.05 R17.2 | U$11.2 10.92,52.83 7.06,52.83 4.62,50.39 4.62,38.2 IN_JACK.SN | 49.33,33.33 49.33,34.95 51.16,36.78 52.17,36.78 54.61,39.22 54.61,40.03 54.41,40.23 51.97,40.23 51.36,39.62 48.11,39.62 IC5.4 | IC6.4 44.66,50.8 39.58,45.72 38.97,45.72 37.75,44.5 37.75,40.44 | C26.- 84.48,7.11 81.84,9.75 79.12,9.75 IC3.3 79,9.35 | 68.43,71.53 73.71,71.53 S3.5 | U$1.GND5 50.43,69.85 50.39,69.81 47.75,69.81 46.97,70.59 46.97,71.95 46.47,72.45 46.47,73.56 | ~NUDEV~1.GND 79.77,8.58 79,9.35 | 79,9.35 78.6,9.75 | C12.2 68.43,72.87 68.43,71.53
  pour Bottom: 23.46,-0.5 23.46,14.73 29.03,20.3 72.8,20.3 73.47,20.96 73.47,21.68 79.17,21.68 79.17,0 90.34,0 90.34,97.86 87.2,101 2.7,101 -1.8,96.5 -1.8,3.5 2.2,-0.5
GND2
  Top 0.203: U2.4 30.43,15.44 30.43,13.41 36.12,7.72 36.12,4.27 ATTINY.5 | C25.- 69.45,7.52 69.85,7.11 73.71,7.11 C32.2 76.84,3.92 ~NUDEV~1.GNDA | R41.1 53.6,7.11 53.6,8.74 54.82,9.96 Q6.1 55.02,10.05 55.02,10.77 57.86,13.61 57.86,15.86 OK2.2
  pour Bottom: 78.53,21.11 78.53,-0.5 23.96,-0.5 23.96,14.46 29.4,19.9 73.04,19.9 73.96,20.82 73.96,21.11
IN
  Top 0.203: U$8.1A 9.5,13.61 10.92,13.61 12.55,15.24 14.58,15.24 15.8,16.46 U$8.3B 16,16.66 16,20.32 17.43,21.74 IN_JACK.T 17.63,21.95 21.49,25.81 | 21.49,25.81 38.76,25.81 40.19,24.38 45.84,24.38 46.85,25.39 K2.4 | 21.49,25.81 24.03,28.35
LEFT_IN
  Top 0.203: R1.1 62.13,62.79 58.47,62.79 C20.1
LEFT_OUT
  Top 0.203: U$1.LOUT 51.77,64.82 46.89,64.82 44.25,67.46 C8.+
N$1
  Top 0.203: 30.23,84.12 30.23,84.73 32.67,87.17 32.67,89.61 R14.1 | 30.23,84.12 32.67,84.12 36.32,80.47 44.05,80.47 C5.+ | 30.23,84.12 Q3.2
N$2
  Top 0.203: U$1.POT0 51.97,74.98 52.58,75.59 52.78,75.59 58.27,81.08 58.27,82.3 59.29,83.31 60.1,83.31 61.72,84.94 MOD3.2
N$3
  Top 0.203: R6.1 37.95,66.24 40.19,66.24 R9.2 40.39,66.04 43.44,66.04 44.05,65.43 C8.-
N$4
  Top 0.203: 14.38,58.93 14.38,82.09 R16.2 | 14.38,58.93 17.02,56.29 C15.+ | 14.38,58.93 11.74,56.29 11.13,56.29 U$11.1
N$5
  Top 0.203: R7.2 39.17,41.66 39.17,41.25 43.23,37.19 43.23,35.36 44.25,34.34 C1.2 44.45,34.34 46.69,34.34 51.77,39.42 53.19,39.42 IC5.5
N$6
  Top 0.203: R10.2 43.03,70.51 43.03,66.85 43.44,66.45 44.66,66.45 45.47,65.63 45.47,62.38 C4.2
N$7
  Top 0.203: R10.1 43.03,73.56 43.03,77.22 44.05,78.23 C5.-
N$8
  Top 0.203: R9.1 40.19,63.2 40.19,58.93 39.98,58.73 C30.- 39.98,58.52 41.2,57.3 42.83,57.3 C21.1
N$10
  Top 0.203: IC6.2 47.91,53.44 47.91,54.46 IC6.1 48.11,54.66 45.67,57.1 C4.1
N$11  (via drill 0.3)
  Top 0.203: R15.2 19.66,96.52 19.66,93.88 U$4.A | v34.5,88.8 49.53,88.8 52.78,92.05 75.75,92.05 75.95,91.85 77.98,91.85 79.4,90.42 79.4,87.78 77.98,86.36 77.98,84.12 79.4,82.7 79.4,82.09 ASYMETRICAL.5
  Bottom 0.203: v34.5,88.8 30.23,93.07 20.68,93.07 20.07,93.67 19.66,93.67 U$4.A
N$12
  Top 0.203: R30.2 39.98,44.5 41.2,44.5 C37.2 43.84,47.14 46.89,47.14 48.11,48.36 50.75,48.36 51.97,47.14 R29.1 51.97,46.94 51.97,45.52 48.72,42.27 48.11,42.27 IC5.2
N$13
  Top 0.203: VR1.3 62.54,55.07 62.94,55.07 64.37,56.49 69.85,56.49 C35.+
N$14
  Top 0.203: U$1.POT1 51.76,73.76 50.77,73.76 46.08,78.45 46.08,81.28 40.79,86.56 37.39,86.56 MOD2.2
N$15
  Top 0.203: 20.47,72.54 24.74,72.54 ANTI-HISS.2 24.95,72.54 30.43,78.03 30.43,79.45 32.06,81.08 32.06,82.5 Q3.3 | 20.47,72.54 19.25,71.32 C2.+ | 20.47,72.54 19.25,73.76 19.25,76 Q2.1
N$16
  Top 0.203: C13.2 19.25,61.16 22.51,61.16 25.35,64.01 25.96,64.01 R13.1 26.16,64.01 31.24,58.93 31.24,55.88 27.59,52.22 26.37,52.22 R18.2 | C15.- 19.25,56.29 19.25,60.96 C13.2 | R15.1 16.82,96.52 16.82,93.47 U$5.C 16.82,93.27 16.82,92.25 | 16.82,92.25 12.96,88.39 12.96,84.12 13.77,83.31 16,83.31 | 16,83.31 18.85,83.31 20.47,81.69 20.47,79.86 19.25,78.64 Q2.3 | 16.82,92.25 32.87,92.25 35.92,89.2 49.33,89.2 49.94,89.81 49.94,90.41 52.6,93.06 75.34,93.06 76.15,92.25 78.18,92.25 79.81,90.63 79.81,87.58 79.61,87.38 79.61,84.73 ASYMETRICAL.4 | 16,83.31 16,67.87 19.05,64.82 19.05,61.16 C13.2
  Bottom 0.203: ASYMETRICAL.6 79.4,79.65 79.4,80.06 77.98,81.48 77.98,82.5 78.39,82.91 78.39,83.11 79.4,84.12 79.4,84.53 ASYMETRICAL.4
N$17
  Top 0.203: R16.1 14.38,84.94 22.51,84.94 22.71,84.73 GAIN.3
N$18
  Top 0.203: 25.15,84.94 23.73,86.36 19.66,86.36 C9.1 | 25.15,84.94 25.55,84.53 25.55,79.25 R17.1 | 25.15,84.94 29.82,89.61 R14.2 30.03,89.81 31.04,90.83 33.68,90.83 33.89,90.63 33.89,87.78 32.26,86.16 32.26,85.34 Q3.1
N$19
  Top 0.203: 51.97,72.54 U$1.POT2 51.93,72.45 52.08,72.45 52.83,73.2 52.83,74.12 52.63,74.32 51.05,74.32 48.83,76.54 MOD1.2
N$20
  Top 0.203: R32.1 48.52,56.9 48.52,55.88 49.53,54.86 49.53,53.03 48.72,52.22 48.11,52.22 IC6.3 47.91,52.22 47.3,52.22 46.48,53.03 43.84,53.03 41.2,55.68 39.98,55.68 C30.+
N$21
  Top 0.203: R11.1 39.17,47.55 39.17,51 U$23.1 39.37,51.21 43.23,51.21 44.05,52.02 C18.+ 44.25,52.02 44.86,51.41 49.33,51.41 49.94,50.8 IC6.5
N$22
  Top 0.203: IC5.3 48.11,41.05 51.56,41.05 51.97,41.45 56.85,41.45 57.05,41.66 C23.-
N$23
  Top 0.203: IC6.7 53.19,53.44 51.36,53.44 50.95,53.85 50.95,54.25 54.82,58.12 55.83,58.12 U$2.A | 58.68,47.75 58.68,49.99 C36.1 58.47,49.99 56.03,52.43 U$3.C | 58.68,47.75 58.68,46.94 R23.2 | 58.68,47.75 69.85,47.75 C22.1 | 58.68,47.75 R23.2 | C23.+ 57.25,43.89 57.25,45.31 58.68,46.74 R23.2
  Bottom 0.203: U$2.A 55.83,58.12 55.63,58.12 54.61,57.1 54.61,54.66 56.03,53.24 56.03,52.63 U$3.C
N$24
  Top 0.203: R27.2 55.83,60.55 61.72,60.55 63.76,58.52 69.85,58.52 C35.-
N$25
  Top 0.203: 19.05,47.95 19.05,45.52 17.22,43.69 C16.+ | 19.05,47.95 19.05,48.77 Q4.3 | 19.05,47.95 27.99,47.95 28.81,48.77 32.06,48.77 Q5.1
N$26
  Top 0.203: 63.35,86.16 63.35,83.72 60.91,81.28 U$1.SCK | 63.35,86.16 62.94,86.56 57.46,86.56 56.64,85.75 56.64,85.14 IC1.6 | 63.35,86.16 63.76,86.56 70.67,86.56 71.68,87.58 71.68,87.78 72.9,89 EEPROM.2
N$27
  Top 0.203: 44.25,43.69 47.7,43.69 47.91,43.48 IC5.1 48.11,43.48 48.72,44.09 48.72,46.94 R29.2 | 44.25,43.69 C37.1 43.84,43.69 | 44.25,43.69 44.25,39.62 C24.+
N$28
  Top 0.203: U$1.SDA 51.97,81.28 51.97,81.69 55.22,84.94 IC1.5 55.22,85.14 55.22,85.75 56.85,87.38 58.07,87.38 59.69,89 70.26,89 EEPROM.1
N$29
  Top 0.203: C34.2 5.64,45.11 6.45,45.92 10.92,45.92 R20.1 11.13,46.13 12.35,46.13 | 12.35,46.13 16.21,49.99 17.02,49.99 Q4.2 | 12.35,46.13 16.21,42.27 18.24,42.27 25.35,35.15 26.57,35.15 GAIN.2
N$30
  Top 0.203: 62.94,64.82 60.91,64.82 U$1.LIN | 62.94,64.82 63.15,65.02 C7.2 62.94,64.82 | 62.94,64.82 64.98,62.79 R1.2
N$31
  Top 0.203: Q5.2 30.23,50.19 30.23,53.03 32.06,54.86 32.06,56.08 C19.+ 32.06,56.29 32.06,62.38 31.45,62.99 31.45,66.24 | 31.45,66.24 32.06,66.24 32.26,66.45 U$7.A | 31.45,66.24 30.03,66.24 U$6.C 29.82,66.24 29.82,70.71 C28.1 30.03,70.92 33.28,74.17 33.28,82.91 32.46,83.72 31.85,83.72 29.42,81.28 29.42,79.25 R21.2
N$32
  Top 0.203: C14.2 17.02,86.56 17.02,90.83 U$5.A 17.02,91.03 17.22,91.24 19.46,91.24 U$4.C
N$33
  Top 0.203: U$1.MID 60.91,67.46 63.35,67.46 64.16,68.28 C3.+
N$34
  Top 0.203: F1.2 86.31,14.63 86.31,17.07 86.51,17.27 LSP4.MP
N$35
  Top 0.203: C34.1 5.64,49.99 6.66,48.97 10.92,48.97 R20.2 11.13,48.97 14.58,48.97 17.02,51.41 19.05,51.41 Q4.1 19.25,51.61 19.66,52.02 23.32,52.02 R19.1 23.52,52.22 27.38,56.08 30.03,56.08 C19.-
N$36  (via drill 0.3)
  Top 0.203: v35.51,37.8 30.63,37.8 28.2,40.23 26.37,40.23 R31.2
  Bottom 0.203: v35.51,37.8 43.44,37.8 43.64,37.59 44.05,37.59 C24.-
N$38
  Top 0.203: R23.1 56.03,46.94 56.03,49.99 U$3.A 55.83,50.19 54,52.02 | 54,52.02 53.39,52.02 IC6.6 54,52.02 | C22.2 69.85,52.63 65.79,52.63 63.76,50.6 VR1.2 63.55,50.6 62.94,50.6 58.68,54.86 C36.2 58.47,55.07 57.86,55.68 56.03,55.68 U$2.C 55.83,55.68 54.82,54.66 54.82,52.83 54,52.02
N$39
  Top 0.203: R35.1 23.52,46.53 23.52,44.3 R36.1 23.52,44.09 24.13,44.09 26.57,41.66 27.38,41.66 29.82,39.22 36.12,39.22 C41.1 36.12,39.01 36.12,35.76 30.23,29.87 C33.+ 30.23,29.67 32.06,27.84 37.95,27.84 ANTI-HISS1.1
N$40
  Top 0.203: 17.02,81.48 19.46,81.48 C9.2 | 17.02,81.48 17.02,77.42 Q2.2 17.22,77.22 17.22,72.54 18.24,71.53 18.24,66.85 19.05,66.04 C13.1 19.25,65.84 20.88,64.21 23.12,64.21 R13.2 23.32,64.21 24.74,65.63 24.74,69.09 ANTI-HISS.1 | 17.02,81.48 C14.1
N$41  (via drill 0.3)
  Top 0.203: v33.89,41.25 31.24,43.89 R33.1 | 58.27,42.27 58.27,41.45 57.66,40.84 53.39,40.84 IC5.6 53.19,40.84 51.97,40.84 51.36,40.23 46.69,40.23 45.06,38.61 43.23,38.61 41,40.84 v40.39,40.84 | 58.27,42.27 57.66,42.88 54.61,42.88 54,42.27 53.39,42.27 IC5.7 | 58.27,42.27 65.79,42.27 70.87,47.35 70.87,53.03 70.26,53.65 69.65,53.65 69.45,53.44 61.72,53.44 58.47,56.69 58.47,57.51 C20.2
  Bottom 0.203: 33.89,40.84 33.89,28.25 31.04,25.4 31.04,24.99 C29.+ | 33.89,40.84 v33.89,41.25 | v40.39,40.84 33.89,40.84
N$43
  Top 0.203: R31.1 23.52,40.23 24.13,40.23 27.99,36.37 27.99,33.73 27.79,33.53 18.44,33.53 15.19,36.78 3.2,36.78 2.39,37.59 2.39,76 9.71,83.31 9.71,84.53 VOL.3
N$46
  Top 0.203: U$1.REFP 51.77,67.46 51.36,67.46 50.17,68.66 R8.1 48.1,68.66 C6.+
N$51
  Top 0.203: R21.1 32.06,79.05 32.06,77.83 30.03,75.79 C28.2 29.82,75.59 29.82,71.93 28.81,70.92 28.81,64.62 29.82,63.6 U$6.A | R22.2 35.31,66.24 34.7,66.24 32.46,64.01 U$7.C 32.46,63.8 33.28,62.99 33.28,55.47 32.26,54.46 32.26,51.41 Q5.3
  Bottom 0.203: C18.- 44.05,54.05 43.64,53.65 43.44,53.65 42.01,52.22 33.28,52.22 32.26,51.21 Q5.3 | U$6.A 30.03,63.4 31.04,63.4 31.85,64.21 32.06,64.21 32.26,64.01 U$7.C
N$52
  Top 0.203: U$1.T0 60.91,79.86 64.01,79.86 67.42,76.44 68.51,76.44 70.53,74.43 R12.2 70.53,73.13
N$53
  Top 0.203: U$1.X2 60.91,74.78 62.94,74.78 64.16,73.56 Q1.P$2 | 64.77,73.97 64.37,73.56 Q1.P$2 | Q1.P$2 66.4,75.54 C12.1
N$54
  Top 0.203: U$1.X1 63.35,76.2 64.16,77.01 Q1.P$1
N$59
  Top 0.203: K2.7 44.45,20.93 27.18,20.93 16.41,10.16 15.39,10.16 12.75,12.8 12.75,13.41 U$8.2A
N$74
  Top 0.203: U2.5 30.43,8.13 30.43,4.88 31.04,4.27 ATTINY.3
N$75
  Top 0.203: U2.6 31.65,8.33 31.04,8.94 31.04,9.14 30.84,9.35 30.03,9.35 28.6,7.92 28.6,4.27 ATTINY.2 28.4,4.06 30.63,1.83 39.17,1.83 44.25,6.91 49.53,6.91 R46.2
N$76
  Top 0.203: U2.7 33.07,8.13 33.07,4.67 33.48,4.27 ATTINY.4
N$77
  Top 0.203: U2.1 34.29,15.65 36.73,15.65 36.93,15.85 38.15,15.85 38.97,15.04 38.97,4.47 38.76,4.27 ATTINY.6
N$78
  Top 0.203: LSP6.MP 61.34,17.89 R38.1 67.71,17.89 LED2.A
N$79
  Top 0.203: 44.66,17.88 K2.8 44.45,17.68 43.84,17.68 43.23,17.07 43.23,16.66 44.86,15.04 44.86,13.61 D5.A 44.87,12.24 48.38,8.72 51.15,8.72 Q6.3 | Q6.3 54.59,12.53 | LED2.K 66.84,15.54 66,16.38 62.22,16.38 LSP5.MP 59.07,17.01 59.07,17.57 57.31,17.57 56.4,16.66 56.4,14.68 54.96,13.23 Q6.3
N$84
  Top 0.203: R45.1 56.44,3.66 56.44,6.91 R41.2 56.44,7.11 56.85,7.52 56.85,11.18 Q6.2
N$85
  Top 0.203: 33.07,16.05 33.07,15.76 U2.2 33.7,16.38 33.7,16.51 33.85,16.66 41.2,16.66 43.23,14.63 43.23,12.19 47.4,8.03 51.46,8.03 52.38,7.11 52.38,4.82 R45.2
N$87
  Top 0.203: U2.3 31.85,15.44 32.26,15.04 32.26,14.83 32.67,14.43 37.54,14.43 LSP1.MP
N$88
  Top 0.203: 49.73,9.96 R46.1 55.51,15.56 OK2.1 55.63,15.85
OUT
  Top 0.203: 57.86,22.96 OK2.3 | 44.66,23.16 K2.6 47.51,23.19 48.17,22.54 53.76,22.54 54.77,21.53 56.25,21.53 56.4,21.68 57.91,23.19 OK2.3 | OK2.3 58.17,23.16 59.69,23.16 70.95,34.42 OUT_JACK.T
VB
  Top 0.203: R32.2 48.31,59.94 45.27,59.94 43.03,62.18 C21.2 42.83,62.38 42.83,62.99 41.2,64.62 39.17,64.62 37.95,63.4 R6.2 37.75,63.2 37.75,61.57 36.12,59.94 36.12,51.21 U$23.2 36.12,51 36.12,47.55 R11.2 36.32,47.35 36.32,44.7 R30.1 36.53,44.3 36.32,44.09 36.32,41.86 R7.1 36.12,41.86 34.9,40.64 31.24,40.64 R33.2

### Text on the board
tPlace: BUILT BY: | DATE: | extra board here | GOLDTOOTH FZZSHAPE V3.1
_bPlace: MOD1 | U$8 | MOD2 | MOD3
_tNames: C23 | C17 | C8 | C12 | D2 | D1 | C7 | Q4 | Q3 | R24 | C10 | C6 | C3 | Q1 | K2 | D4 | R6 | C11 | R12 | R8 | R4 | R3 | R2 | R1 | R22 | R19 | R18 | R17 | R16 | R13 | R10 | LED2 | C24 | J1 | C30 | C32 | C31 | C21 | R9 | R7 | R5 | C9 | R21 | R20 | R15 | R14 | C28 | C13 | C29 | C20 | R23 | R46 | C4 | R11 | C14 | C1 | C19 | C18 | C16 | C15 | C5 | C2 | U$7 | LSP3 | OK2 | LSP2 | LSP4 | U$3 | Q6 | LSP1 | C22 | Q5 | Q2 | VR1 | U$6 | U$5 | U$4 | ASYMETRICAL | C27 | U$2 | R25 | C26 | C25 | S4 | IC3 | D3 | R26 | U2 | R38 | R41 | R45 | S2 | R35 | C33 | S3 | IC4 | IC2 | S1 | IC1
_tDocu: OUT_JACK | IN_JACK